# EAGLE design ESP32Prog (EAGLE 9.6.2)
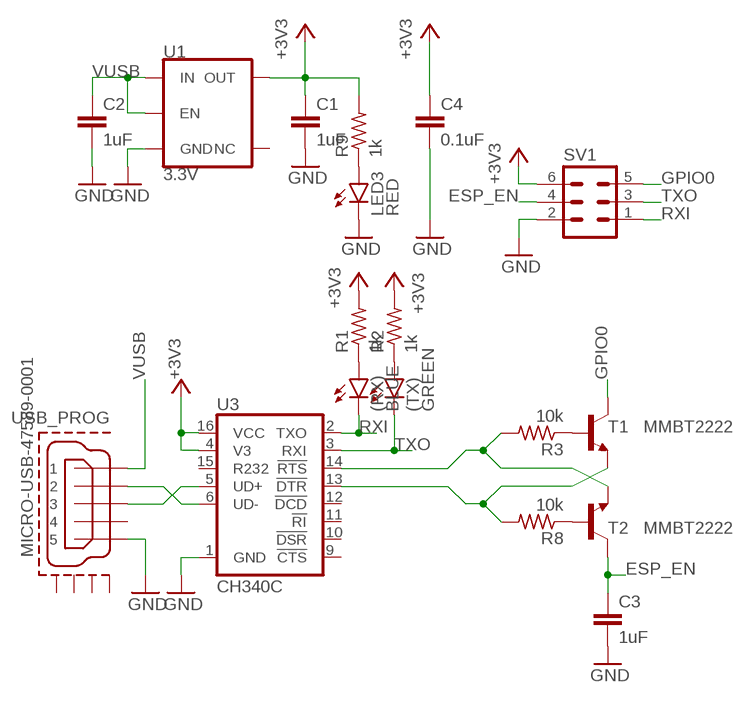
[diagram p0: schematic, sheet 1]

## Parts
(RX)  BLUE  LEDCHIP-LED0603  [CHIP-LED0603]
(TX)  GREEN  LEDCHIP-LED0603  [CHIP-LED0603]
C1  1uF  C-EUC0603K  [C0603K]
C2  1uF  C-EUC0603K  [C0603K]
C3  1uF  C-EUC0603K  [C0603K]
C4  0.1uF  C-EUC0603K  [C0603K]
LED3  RED  LEDCHIP-LED0603  [CHIP-LED0603]
R1  1k  R-US_R0402  [R0402]
R2  1k  R-US_R0402  [R0402]
R3  10k  R-US_R0402  [R0402]
R8  10k  R-US_R0402  [R0402]
R9  1k  R-US_R0402  [R0402]
SV1  MA03-2  [MA03-2]
T1  MMBT2222  MMBT2222ALT1-NPN-SOT23-BEC  [SOT23-BEC]
T2  MMBT2222  MMBT2222ALT1-NPN-SOT23-BEC  [SOT23-BEC]
U1  3.3V  V_REG_AP2112K-3.3V  [SOT23-5]
U3  CH340C  [SO016]
USB_PROG  MICRO-USB-47589-0001  MICRO-USB-RECEPTACLE47589-0001  [47589-0001]

## Nets
+3V3: C1.1 C4.1 R1.2 R2.2 R9.2 SV1.6 U1.5(OUT) U3.4(V3) U3.16(VCC)
DTR: R8.2 T1.E U3.13(!DTR)
ESP_EN: C3.1 SV1.4 T2.C
GND: C1.2 C2.2 C3.2 C4.2 LED3.C SV1.2 U1.2(GND) U3.1(GND) USB_PROG.5
GPIO0: SV1.5 T1.C
N$1: (RX).A R1.1
N$7: U3.6(UD-) USB_PROG.2
N$8: U3.5(UD+) USB_PROG.3
N$10: (TX).A R2.1
N$11: R3.1 T1.B
N$12: R8.1 T2.B
N$13: LED3.A R9.1
RTS: R3.2 T2.E U3.14(!RTS)
RXI: (RX).C SV1.1 U3.2(TXO)
TXO: (TX).C SV1.3 U3.3(RXI)
VUSB: C2.1 U1.1(IN) U1.3(EN) USB_PROG.1
Unconnected: U1.4(NC) U3.9(!CTS) U3.10(!DSR) U3.11(!RI) U3.12(!DCD) U3.15(R232) USB_PROG.4 USB_PROG.CASING1(GND1) USB_PROG.CASING2(GND2) USB_PROG.CASING3(GND3) USB_PROG.CASING4(GND4)

## Library data of the parts
(RX) (TX) LED3 = led:LED: LED OSRAM: - CHIPLED LG R971, LG N971, LY N971, LG Q971, LY Q971, LO R971, LY R971 LH N974, LH R974 LS Q976, LO Q976, LY Q976 LO Q996 - Hyper CHIPLED LW Q18S LB Q993, LB Q99A, LB R99A - SideLED LS A670, LO A670, LY A670, LG A670, LP A670 LB A673, LV A673, LT A673, LW A673 LH A674 LY A675 LS A676, LA A676, LO A676, LY A676, LW A676 LS A679, LY A679, LG A679 - Hyper Micro SIDELED® LS Y876, LA Y876, LO Y876, LY Y876 LT Y87S - SmartLED LW L88C, LW L88S LB L89C, LB L89S, LG L890 LS L89K, LO L89K, LY L89K LS L896, LA L896, LO L896, LY L896 - TOPLED LS T670, LO T670, LY T670, LG T670, LP T670 LSG T670, LSP T670, LSY T670, LOP T670, LYG T670 LG T671, LOG T671, LSG T671 LB T673, LV T673, LT T673, LW T673 LH T674 LS T676, LA T676, LO T676, LY T676, LB T676, LH T676, LSB T676, LW T676 LB T67C, LV T67C, LT T67C, LS T67K, LO T67K, LY T67K, LW E67C LS E67B, LA E67B, LO E67B, LY E67B, LB E67C, LV E67C, LT E67C LW T67C LS T679, LY T679, LG T679 LS T770, LO T770, LY T770, LG T770, LP T770 LB T773, LV T773, LT T773, LW T773 LH T774 LS E675, LA E675, LY E675, LS T675 LS T776, LA T776, LO T776, LY T776, LB T776 LHGB T686 LT T68C, LB T68C - Hyper Mini TOPLED® LB M676 - Mini TOPLED Santana® LG M470 LS M47K, LO M47K, LY M47K Source: http://www.osram.convergy.de LUXEON: - LUMILED® LXK2-PW12-R00, LXK2-PW12-S00, LXK2-PW14-U00, LXK2-PW14-V00 LXK2-PM12-R00, LXK2-PM12-S00, LXK2-PM14-U00 LXK2-PE12-Q00, LXK2-PE12-R00, LXK2-PE12-S00, LXK2-PE14-T00, LXK2-PE14-U00 LXK2-PB12-K00, LXK2-PB12-L00, LXK2-PB12-M00, LXK2-PB14-N00, LXK2-PB14-P00, LXK2-PB14-Q00 LXK2-PR12-L00, LXK2-PR12-M00, LXK2-PR14-Q00, LXK2-PR14-R00 LXK2-PD12-Q00, LXK2-PD12-R00, LXK2-PD12-S00 LXK2-PH12-R00, LXK2-PH12-S00 LXK2-PL12-P00, LXK2-PL12-Q00, LXK2-PL12-R00 Source: www.luxeon.com KINGBRIGHT: KA-3528ASYC Source: www.kingbright.com
C1-C4 = rcl:C-EU: CAPACITOR, European symbol; SPICEPREFIX: C
R1-R3 R8 R9 = rcl:R-US_: RESISTOR, American symbol; SPICEPREFIX: R
SV1 = con-lstb:MA03-2: PIN HEADER; OC_FARNELL: unknown; OC_NEWARK: unknown
T1 T2 = transistor:*-NPN-: NPN Transistror BF959 corrected 2008.03.06
U1 = SparkFun-IC-Power:V_REG_AP2112: AP2112 - 600mA CMOS LDO Regulator w/ Enable The AP2112 is CMOS process low dropout linear regulator with enable function, the regulator delivers a guaranteed 600mA (min.) continuous load current. Features Output Voltage Accuracy: ±1.5% Output Current: 600mA (Min.) Foldback Short Current Protection: 50mA Enable Function to Turn ON/OFF VOUT Low Dropout Voltage (3.3V): 250mV (Typ.) @IOUT=600mA Excellent Load Regulation: 0.2%/A (Typ.) Excellent Line Regulation: 0.02%/V (Typ.) Low Quiescent Current: 55μA (Typ.) Low Standby Current: 0.01μA (Typ.) Low Output Noise: 50μVRMS PSRR: 100Hz -65dB, 1kHz -65dB OTSD Protection Stable with 1.0μF Flexible Cap: Ceramic, Tantalum and Aluminum Electrolytic Operation Temperature Range: -40°C to 85°C ESD: MM 400V, HBM 4000V; PROD_ID: VREG-12457
U3 = SparkFun-IC-Comms:CH340C; PROD_ID: IC-14038
USB_PROG = con-molex-usb:MICRO-USB-RECEPTACLE: MICRO USB RECEPTACLES Micro-USB Receptacles, SMT, Lead-Free from MOLEX <http://www.molex.com/>. (C) 2014 Tomasz Boleslaw CEDRO, cederom@tlen.pl, http://www.tomek.cedro.info. Version 0.1 (2014-01-17): Initial release. Version 0.2 (2014-02-06): Updated 47589-0001 footprint pins/pads/milling. Following devices are included: 1. 47589-0001 Micro-USB AB Receptacle, Bottom Mount, SMT, Lead-Free <http://www.molex.com/molex/products/datasheet.jsp?part=active/0475890001_IO_CONNECTORS.xml> (Technical Drawing <http://www.molex.com/pdm_docs/sd/475890001_sd.pdf>).

## Board
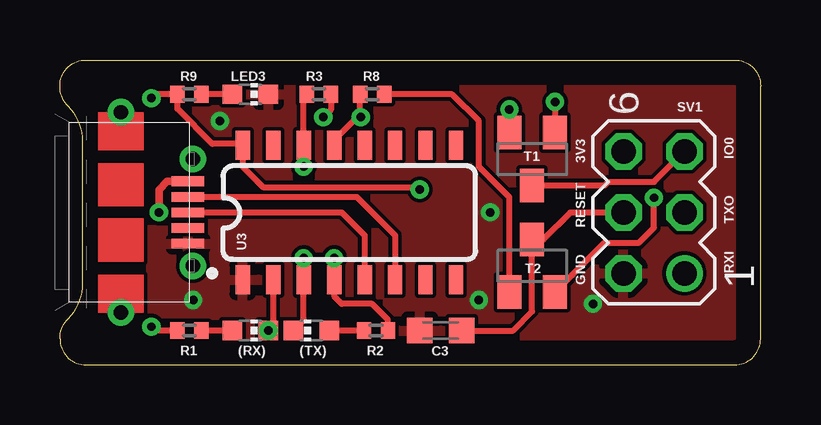
[diagram p1: board, top side]
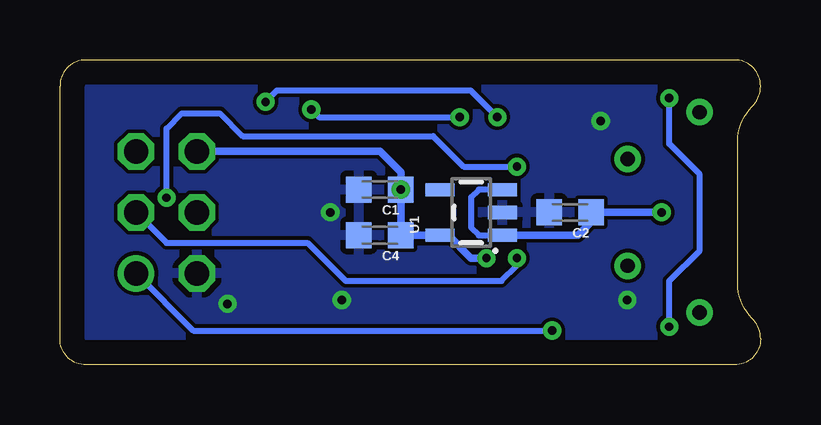
[diagram p2: board, bottom side, seen from below]

Size 29.21 x 12.7 mm. Coordinates in mm from the lower left corner, seen from the top.
Outline: 1.08,12.7 28.13,12.7 arc-90 29.21,11.62 29.21,1.08 arc-90 28.13,0 1.08,0 arc-90 0,1.08 arc-45 0.36,1.94 arc45 0.95,3.38 0.95,9.32 arc45 0.36,10.76 arc-45 0,11.62 arc-90 1.08,12.7
Copper layers (1*16): Top 0.035mm / dielectric 1.5mm / Bottom 0.035mm
Design rules "default *": minimum track width 6mil, minimum drill 0.35mm, track to track 6mil, track to pad 6mil, pad to pad 6mil, via to via 6mil, smd to smd 6mil, copper to edge 40mil, drill to drill 6mil, minimum pad ring 10mil, minimum via ring 8mil, stop-mask expansion 4mil, vias tented up to drill 14mil, thermal gap 10mil

### Footprints (pad centres in the part's own frame; a part is rotated, then mirrored left to right if it is on the bottom)
CHIP-LED0603 = smd 0.8 x 0.8: A 0,-0.75; C 0,0.75
C0603K = smd 1.05 x 1.08: 1 -0.875,0; 2 0.875,0
R0402 = smd 0.6 x 0.7: 1 -0.5,0; 2 0.5,0
MA03-2 = drill 1.016: 1 -2.54,-1.27 | drill 1.016 octagon: 2 -2.54,1.27; 3 0,-1.27; 4 0,1.27; 5 2.54,-1.27; 6 2.54,1.27
SOT23-BEC = smd 1 x 1.4: B -0.95,-1.1; C 0,1.1; E 0.95,-1.1
SOT23-5 = smd 0.55 x 1.2: 1 -0.95,-1.3; 2 0,-1.3; 3 0.95,-1.3; 4 0.95,1.3; 5 -0.95,1.3
SO016 = smd 0.6 x 1.2: 1 -4.445,-2.8; 2 -3.175,-2.8; 3 -1.905,-2.8; 4 -0.635,-2.8; 5 0.635,-2.8; 6 1.905,-2.8; 7 3.175,-2.8; 8 4.445,-2.8; 9 4.445,2.8; 10 3.175,2.8; 11 1.905,2.8; 12 0.635,2.8; 13 -0.635,2.8; 14 -1.905,2.8; 15 -3.175,2.8; 16 -4.445,2.8
47589-0001 = smd 1.35 x 0.4: 1 2.8,1.3; 2 2.8,0.65; 3 2.8,0; 4 2.8,-0.65; 5 2.8,-1.3 | drill 0.6 pad 0.95: CASING1 0,4.175; CASING2 0,-4.175; CASING3 3,2.225; CASING4 3,-2.225

### Placement (x,y rotation side)
(RX)  7.94,1.43 270 top
(TX)  10.48,1.43 90 top
C1  15.88,7.3 180 bottom
C2  7.94,6.35 180 bottom
C3  15.88,1.43 180 top
C4  15.88,5.4 180 bottom
LED3  7.94,11.27 270 top
R1  5.4,1.43 180 top
R2  13.18,1.43 0 top
R3  10.79,11.27 180 top
R8  13.02,11.27 180 top
R9  5.4,11.27 180 top
SV1  24.77,6.35 90 top
T1  19.68,8.57 180 top
T2  19.68,4.13 0 top
U1  12.06,6.35 90 bottom
U3  12.06,6.35 0 top
USB_PROG  2.54,6.35 0 top

### Tracks (layer width: path | path; a pad name or v marks a point on that pad's centre or on a via)
+3V3  (via drill 0.35)
  Top 0.254: U3.4 11.43,2.86 11.75,2.54 13.02,2.54 13.68,1.88 R2.2 | C1.1 14.9,7.41 8.47,7.41 7.62,8.26 U3.16 7.56,9.21 6.35,9.21 4.9,10.66 R9.2 3.97,11.27 v3.81,11.11 | R1.2 3.97,1.43 v3.81,1.59
  Top 0.305: v11.43,4.45 U3.4
  Bottom 0.254: v3.81,1.59 3.81,3.49 2.54,4.76 2.54,7.94 3.81,9.21 v3.81,11.11
  Bottom 0.305: v11.43,4.45 12.06,4.45 13.02,5.4 U1.5 C4.1 C1.1 15,8.02 15.88,8.89 SV1.6
  other vias: 15,7.3
DTR  (via drill 0.35)
  Top 0.254: T1.E v18.73,10.64 | R8.2 12.52,10.34 v12.54,10.32 12.38,10.32 11.43,9.37 U3.13
  Bottom 0.254: v18.73,10.64 18.41,10.32 v12.54,10.32
ESP_EN
  Top 0.254: C3.1 18.89,1.43 19.68,2.22 T2.C 20.16,5.23 21.27,6.34 22.53,6.34 22.54,6.35 SV1.4
GND  (via drill 0.35)
  other vias: 22.23,2.54 17.46,2.7 17.94,6.35 5.56,2.7 6.67,10.16
  pour Top: 0,0 0,12.7 29.21,12.7 29.21,0
  pour Bottom: 0,0 0,12.7 29.21,12.7 29.21,0
GPIO0
  Top 0.254: T1.C 22.71,7.47 22.86,7.62 24.77,7.62 SV1.5
N$1
  Top 0.254: (RX).A R1.1
N$7
  Top 0.254: USB_PROG.2 12.37,7 13.97,5.4 U3.6
N$8
  Top 0.254: USB_PROG.3 11.75,6.35 12.7,5.4 U3.5
N$10
  Top 0.254: R2.1 (TX).A
N$11  (via drill 0.35)
  Top 0.254: v20.64,10.95 T1.B | R3.1 11.29,10.64 v10.98,10.32
  Bottom 0.254: v10.98,10.32 12.09,11.43 20.16,11.43 v20.64,10.95
N$12
  Top 0.254: T2.B 18.73,6.98 17.46,8.26 17.46,10.16 16.35,11.27 R8.1
N$13
  Top 0.254: LED3.A R9.1
RTS  (via drill 0.35)
  Top 0.254: R3.2 10.16,11.14 U3.14 v10.16,8.26 | T2.E 22.69,5.08 24.13,5.08 24.77,5.71 v24.77,6.96
  Bottom 0.254: v24.77,6.96 24.77,9.84 24.13,10.48 22.54,10.48 21.59,9.53 13.65,9.53 12.38,8.26 v10.16,8.26
RXI  (via drill 0.35)
  Top 0.254: U3.2 8.89,1.63 (RX).C
  Bottom 0.254: SV1.1 23.65,1.43 (RX).C
  other vias: 8.69,1.43
TXO  (via drill 0.35)
  Top 0.254: (TX).C 10.16,1.86 U3.3 v10.16,4.45
  Bottom 0.254: SV1.3 24.77,5.08 18.89,5.08 17.3,3.49 10.79,3.49 10.16,4.13 v10.16,4.45
VUSB  (via drill 0.35)
  Top 0.305: v4.13,6.35 4.13,7.3 4.47,7.65 USB_PROG.1
  Bottom 0.254: U1.3 11.75,7.3 12.06,6.99 12.06,5.71 11.75,5.4 U1.1
  Bottom 0.305: U1.1 7.62,5.4 7.06,5.96 C2.1 v4.13,6.35

### Text on the board
tPlace: IO0 | 3V3 | RESET | TXO | RXI | GND